# Altium project analogParachuteController.PrjPcb
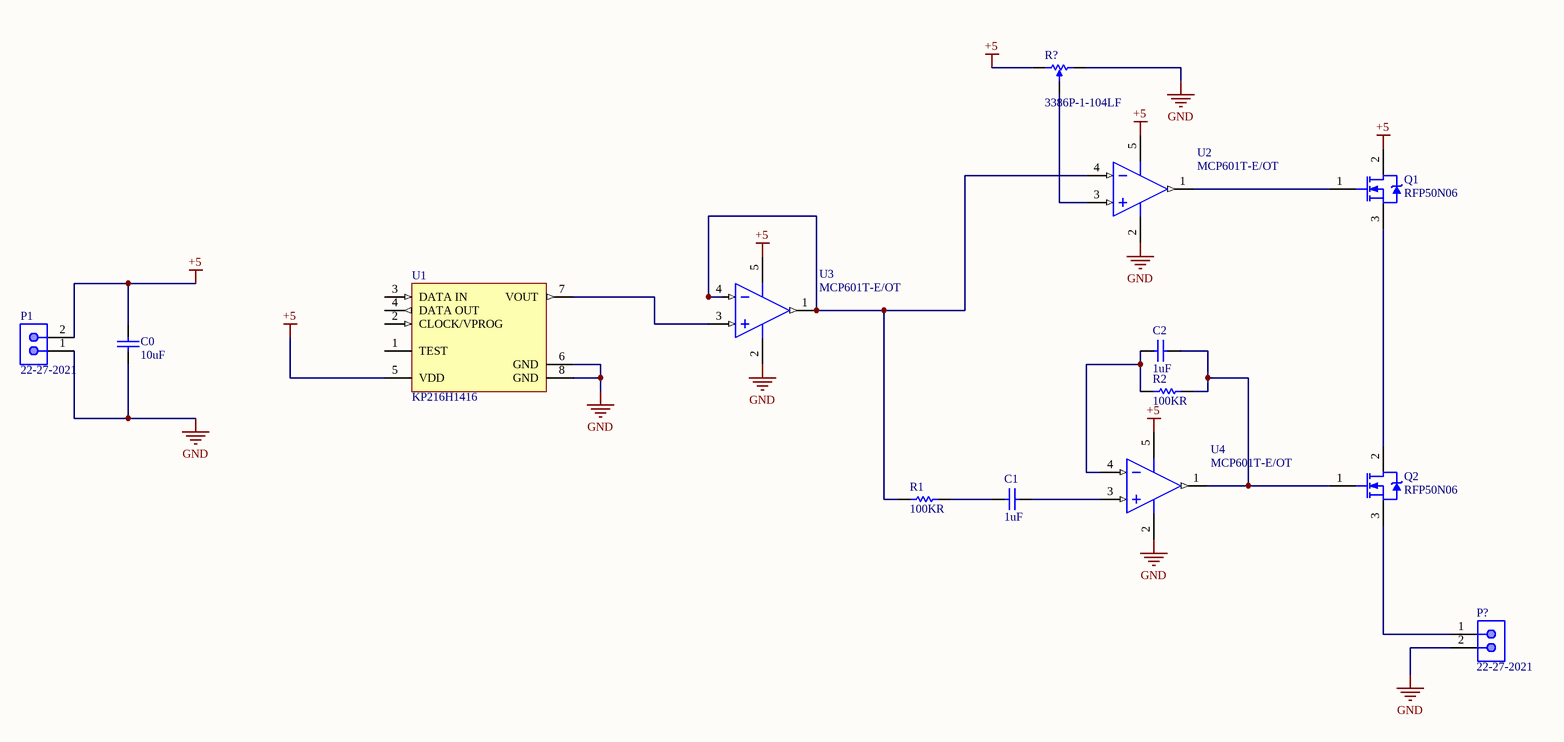
[diagram p0: analogParachuteController.SchDoc]
1 sheet, 14 parts. Net scope: global (net labels, ports and power ports of the same name join across sheets).
Board file: analogParachuteController.PcbDoc

## Sheet analogParachuteController.SchDoc
size B

### Parts
C0  10uF  [CAPC1608X90X35NL10T15]
C1  1uF  [CAPC1608X90X35LL15T15]
C2  1uF  [CAPC1608X90X35LL15T15]
P1  22-27-2021  [MOLX-22-27-2021_V]
P2  22-27-2021  [MOLX-22-27-2021_V]
Q1  RFP50N06  [FAIR-TO-220AB-3]
Q2  RFP50N06  [FAIR-TO-220AB-3]
R1  100KR  [RESC2013X50X30ML20T20]
R2  100KR  [RESC2013X50X30ML20T20]
R3  3386P-1-104LF  [BOUR-3386P]
U1  KP216H1416  [INF-DSOF-8-16_V]
U2  MCP601T-E/OT  [SOT-23-OT5_N]
U3  MCP601T-E/OT  [SOT-23-OT5_N]
U4  MCP601T-E/OT  [SOT-23-OT5_N]

### Nets
+5: C0.2 P1.2 Q1.2(D) R3.1 U1.5(VDD) U2.5(VDD) U3.5(VDD) U4.5(VDD)
GND: C0.1 P1.1 P2.2 R3.3 U1.6(GND) U1.8(GND) U2.2(VSS) U3.2(VSS) U4.2(VSS)
NetC1_1: C1.1 R1.2
NetC1_2: C1.2 U4.3(VIN+)
NetC2_1: C2.1 R2.1 U4.4(VIN-)
NetC2_2: C2.2 Q2.1(G) R2.2 U4.1(VOUT)
NetP2_1: P2.1 Q2.3(S)
NetQ1_1: Q1.1(G) U2.1(VOUT)
NetQ1_3: Q1.3(S) Q2.2(D)
NetR1_1: R1.1 U2.4(VIN-) U3.1(VOUT) U3.4(VIN-)
NetR3_2: R3.2 U2.3(VIN+)
NetU1_7: U1.7(VOUT) U3.3(VIN+)

Not connected (* = marked no-connect by the designer): U1 1(TEST) 2(CLOCK/VPROG) 3(DATA_IN) 4(DATA_OUT)

### Library data of the parts
C0 = CMP-2006-02792-1: Part Number: GRM188R60J106ME47D; Manufacturer: Murata
C1 C2 = CMP-2006-04551-1: Part Number: 0603ZC105KAT2A; Manufacturer: AVX Interconnect / Elco
P1 P2 = CMP-2000-05537-1: Male Header, Pitch 2.54 mm, 1 x 2 Position, Height 11.7 mm, Tail Length 3.56 mm, 0 to 75 degC, RoHS, Bulk; Manufacturer: Molex; PartNumber: 0022272021; Current rating: 4A; Package Version: Rev. BC, 02/2012; Voltage rating: 250V; No. of Positions: 2; Pitch: 2.54mm; No. of Rows: 1; Orientation: Vertical; Operating temperature: 0°Cto+75°C; Manufacturer URL: http://www.molex.com/; Mounting Technology: ThroughHole; Housing material: Nylon(UL94V-0); Package Description: 2-Leads Header, Body 5.08 x 5.8 mm, Pitch 2.54 mm; Voltage - Max: 250V; Datasheet URL: http://www.molex.com/pdm_docs/sd/022272021_sd.pdf; Package Reference: 22-27-2021; Contact material: Tinplatedbrass; Current - Max: 4A; Datasheet Version: Rev. F, 06/2009
Q1 Q2 = CMP-2000-06978-1: N-Channel Power MOSFET, 60 V, 50 A, 22 mOhm, -55 to 175 degC, 3-Pin FM (TO-220AB), RoHS, Tube; Manufacturer: Fairchild Semiconductor; Rated Power Dissipation: 131W; Drain-Source On Resistance-Max: 0.022O; Qg Gate Charge: 150nC; Drain-to-Source Voltage [Vdss]: 60V; Channel Type: N-Channel; Mounting Technology: ThroughHole; Datasheet Version: Rev. C0, 09/2013; Package Description: 3-Pin Through Hole Device, Body 10.16 x 4.35 mm, Pitch 2.535 mm; Package Reference: TO-220AB-3; Manufacturer URL: https://www.fairchildsemi.com/; Datasheet URL: https://www.fairchildsemi.com/datasheets/RF/RFP50N06.pdf; Package URL: https://www.fairchildsemi.com/package-drawings/TO/TO220B03.pdf
R1 R2 = CMP-2001-04900-1: Manufacturer: Vishay Dale; Part Number: CRCW0805100KJNEA
R3 = CMP-2000-05592-1: Square Trimpot(R) Trimming Potentiometer, 100 KOhm, +/- 10%, 0.5 W, -55 to 125 degC, 3-Pin THD, RoHS, Tube; Manufacturer Series: 3386; Manufacturer: Bourns; Resistive Element Material: Cermet; Shaft Diameter: 3.15mm; Number of Turns: 1; Product Height: 4.83mm; Temperature Coefficient: 100ppm/C; Product Depth: 9.53mm; Rated Temperature (Cel): 85; Actuator Orientation: Vertical; Resistance (ohm): 100000; Power Rating: 1/2W; Tolerance (%): 10; Rated Power Dissipation (P) (W): 0.5; Resistance Law: Linear; Actuator Type: Screw; Operating Temperature-Min (Cel): -55; Manufacturer URL: http://www.bourns.com/; Terminal Finish: TINLEAD; Datasheet Version: 05/2016; Tolerance: 10%; Lead Free: NO; Family: 3386; Product Length: 9.53mm; Mounting: ThroughHole; Packaging: Tube; Package: RectangularPackage; Mounting Feature: ThroughHole; Number of Terminals: 3; Minimum Operating Temperature: -55C; Mounting Technology: ThroughHole; Package Reference: 3386P; Maximum Operating Temperature: 125C; Termination Style: Pin; Datasheet URL: http://www.bourns.com/docs/Product-Datasheets/3386.pdf; Package Description: 3-Pin Through Hole Device, Body 9.53 x 9.53 mm, Pitch 2.54 mm; Product Type: Potentiometer; Operating Temperature-Max (Cel): 125; Resistance Value: 100KOhm; Terminal Shape: WIRE; Technology: Cermet; Type: Trimmer
U1 = CMP-1087-00008-1: Analog Absolute Pressure Sensor, -40 to 140 degC, DSOF-8-16, Reel, Green; Manufacturer: Infineon; Pressure Range [kPa]: 50 - 150; Supply Voltage: 5 V; Green: TRUE; ComponentLink2Description: Datasheet; Halogen-free: TRUE; ComponentLink1URL: http://www.infineon.com/; ComponentLink2URL: http://www.infineon.com/dgdl/KP216H1416_DS_Rev_+1.1.pdf?folderId=db3a30431d8a6b3c011dd8fc5a954267&fileId=db3a30432ad629a6012af6b321c40b4a; PackageDescription: 8-Pin Plastic (Green) Dual Small Outline Flat Package, 7 x 7 mm Body, 1.27 mm Pitch; ComponentLink1Description: Manufacturer URL; PartNumber: KP216H1416; DatasheetVersion: Rev. 1.1; Mounting Technology: Surface Mount; RevisionNote: Lost Devices pt2; ComponentLink3Description: Package Specification; PackageVersion: Jun-10; PackageReference: DSOF-8-16; Packing: Reel; ComponentLink3URL: http://www.infineon.com/dgdl/KP234_DS_Rev_1.0.pdf?folderId=db3a30431d8a6b3c011dd8fc5a954267&fileId=db3a30432ad629a6012af66bbf030b08
U2-U4 = CMP-0187-00431-2: 2.7V to 6.0V Single Supply CMOS Operational Amplifier, 5-Pin SOT-23, Extended Temperature, Tape and Reel; Code_IPC: SOT23-5; PackageReference: SOT-23-OT5; ComponentLink2URL: http://ww1.microchip.com/downloads/en/DeviceDoc/21314g.pdf; ComponentLink2Description: Datasheet; ComponentLink1URL: http://www.microchip.com/; ComponentLink3URL: http://www.microchip.com/stellent/groups/techpub_sg/documents/packagingspec/en012702.pdf; ComponentLink1Description: Manufacturer URL; PackageVersion: revBB, Aug-2009; PackageDescription: 5-Lead Plastic Small Outline Transistor (OT) [SOT-23]; ComponentLink3Description: Package Specification; RevisionNote: URLs added.; DatasheetVersion: revG, Dec-2007